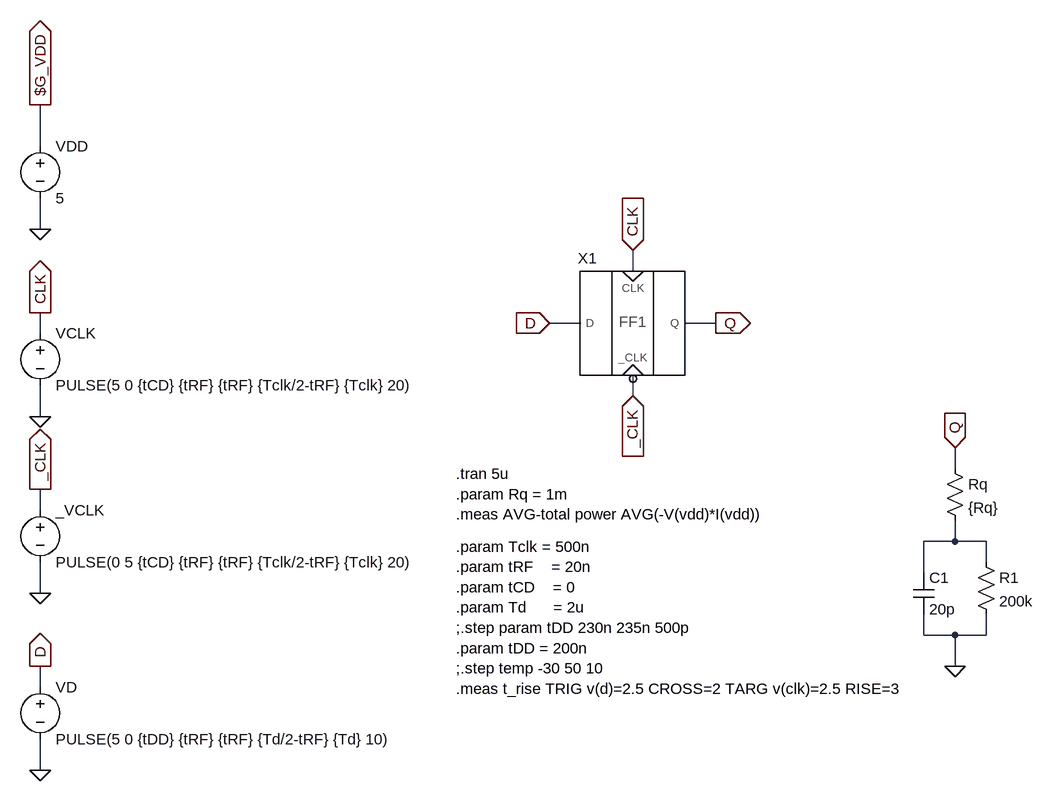
[diagram p0: schematic ff1_top[pulse].asc]
ff1_top[pulse].asc, the LTspice schematic file:
Version 4
SHEET 1 2652 1172
WIRE -640 112 -640 48
WIRE -640 240 -640 192
WIRE 272 304 272 272
WIRE 192 384 144 384
WIRE 400 384 352 384
WIRE -640 400 -640 368
WIRE 272 496 272 464
WIRE -640 528 -640 480
WIRE 768 608 768 576
WIRE -640 672 -640 640
WIRE 768 720 768 688
WIRE 768 720 720 720
WIRE 816 720 768 720
WIRE 816 752 816 720
WIRE 720 768 720 720
WIRE -640 800 -640 752
WIRE 720 864 720 832
WIRE 768 864 720 864
WIRE 816 864 816 832
WIRE 816 864 768 864
WIRE 768 912 768 864
WIRE -640 944 -640 912
WIRE -640 1072 -640 1024
FLAG -640 240 0
FLAG -640 640 _CLK
IOPIN -640 640 Out
FLAG -640 800 0
FLAG -640 368 CLK
IOPIN -640 368 Out
FLAG -640 528 0
FLAG -640 912 D
IOPIN -640 912 Out
FLAG -640 1072 0
FLAG 768 576 Q
IOPIN 768 576 In
FLAG 768 912 0
FLAG 400 384 Q
IOPIN 400 384 Out
FLAG 144 384 D
IOPIN 144 384 In
FLAG 272 272 CLK
IOPIN 272 272 In
FLAG 272 496 _CLK
IOPIN 272 496 In
FLAG -640 48 $G_VDD
IOPIN -640 48 Out
SYMBOL voltage -640 96 R0
WINDOW 123 0 0 Left 2
WINDOW 39 0 0 Left 2
SYMATTR InstName VDD
SYMATTR Value 5
SYMBOL voltage -640 656 R0
WINDOW 123 0 0 Left 2
WINDOW 39 0 0 Left 2
SYMATTR InstName _VCLK
SYMATTR Value PULSE(0 5 {tCD} {tRF} {tRF} {Tclk/2-tRF} {Tclk} 20)
SYMBOL voltage -640 384 R0
WINDOW 123 0 0 Left 2
WINDOW 39 0 0 Left 2
SYMATTR InstName VCLK
SYMATTR Value PULSE(5 0 {tCD} {tRF} {tRF} {Tclk/2-tRF} {Tclk} 20)
SYMBOL voltage -640 928 R0
WINDOW 123 0 0 Left 2
WINDOW 39 0 0 Left 2
SYMATTR InstName VD
SYMATTR Value PULSE(5 0 {tDD} {tRF} {tRF} {Td/2-tRF} {Td} 10)
SYMBOL cap 704 768 R0
SYMATTR InstName C1
SYMATTR Value 20p
SYMBOL res 800 736 R0
SYMATTR InstName R1
SYMATTR Value 200k
SYMBOL res 752 592 R0
SYMATTR InstName Rq
SYMATTR Value {Rq}
SYMBOL ff1 272 384 R0
WINDOW 0 -70 -84 Bottom 2
SYMATTR InstName X1
TEXT 0 616 Left 2 !.tran 5u\n.param Rq = 1m\n.meas AVG-total power AVG(-V(vdd)*I(vdd))
TEXT 0 728 Left 2 !.param Tclk = 500n\n.param tRF    = 20n\n.param tCD    = 0\n.param Td      = 2u\n;.step param tDD 230n 235n 500p\n.param tDD = 200n\n;.step temp -30 50 10\n.meas t_rise TRIG v(d)=2.5 CROSS=2 TARG v(clk)=2.5 RISE=3

The netlist it stands for:
* ff1_top[pulse].asc
VDD $G_VDD 0 5
V§_VCLK _CLK 0 PULSE(0 5 {tCD} {tRF} {tRF} {Tclk/2-tRF} {Tclk} 20)
VCLK CLK 0 PULSE(5 0 {tCD} {tRF} {tRF} {Tclk/2-tRF} {Tclk} 20)
VD D 0 PULSE(5 0 {tDD} {tRF} {tRF} {Td/2-tRF} {Td} 10)
C1 N001 0 20p
R1 N001 0 200k
Rq Q N001 {Rq}
XX1 D CLK _CLK Q ff1  ; pins D CLK _CLK Q
.tran 5u
.param Rq = 1m
.meas AVG-total power AVG(-V(vdd)*I(vdd))
.param Tclk = 500n
.param tRF    = 20n
.param tCD    = 0
.param Td      = 2u
;.step param tDD 230n 235n 500p
.param tDD = 200n
;.step temp -30 50 10
.meas t_rise TRIG v(d)=2.5 CROSS=2 TARG v(clk)=2.5 RISE=3
.backanno
.end